# EasyEDA Pro project ProPrj_EIS-HW-V01_test_2026-05-23.epro, schematic Schematic1

## Sheets
1 P1: Create Date: 2025-07-22; Page Name: P1; Project Name: EIS-HW-V01; Schematic Name: Schematic1; Update Date: 2026-01-30
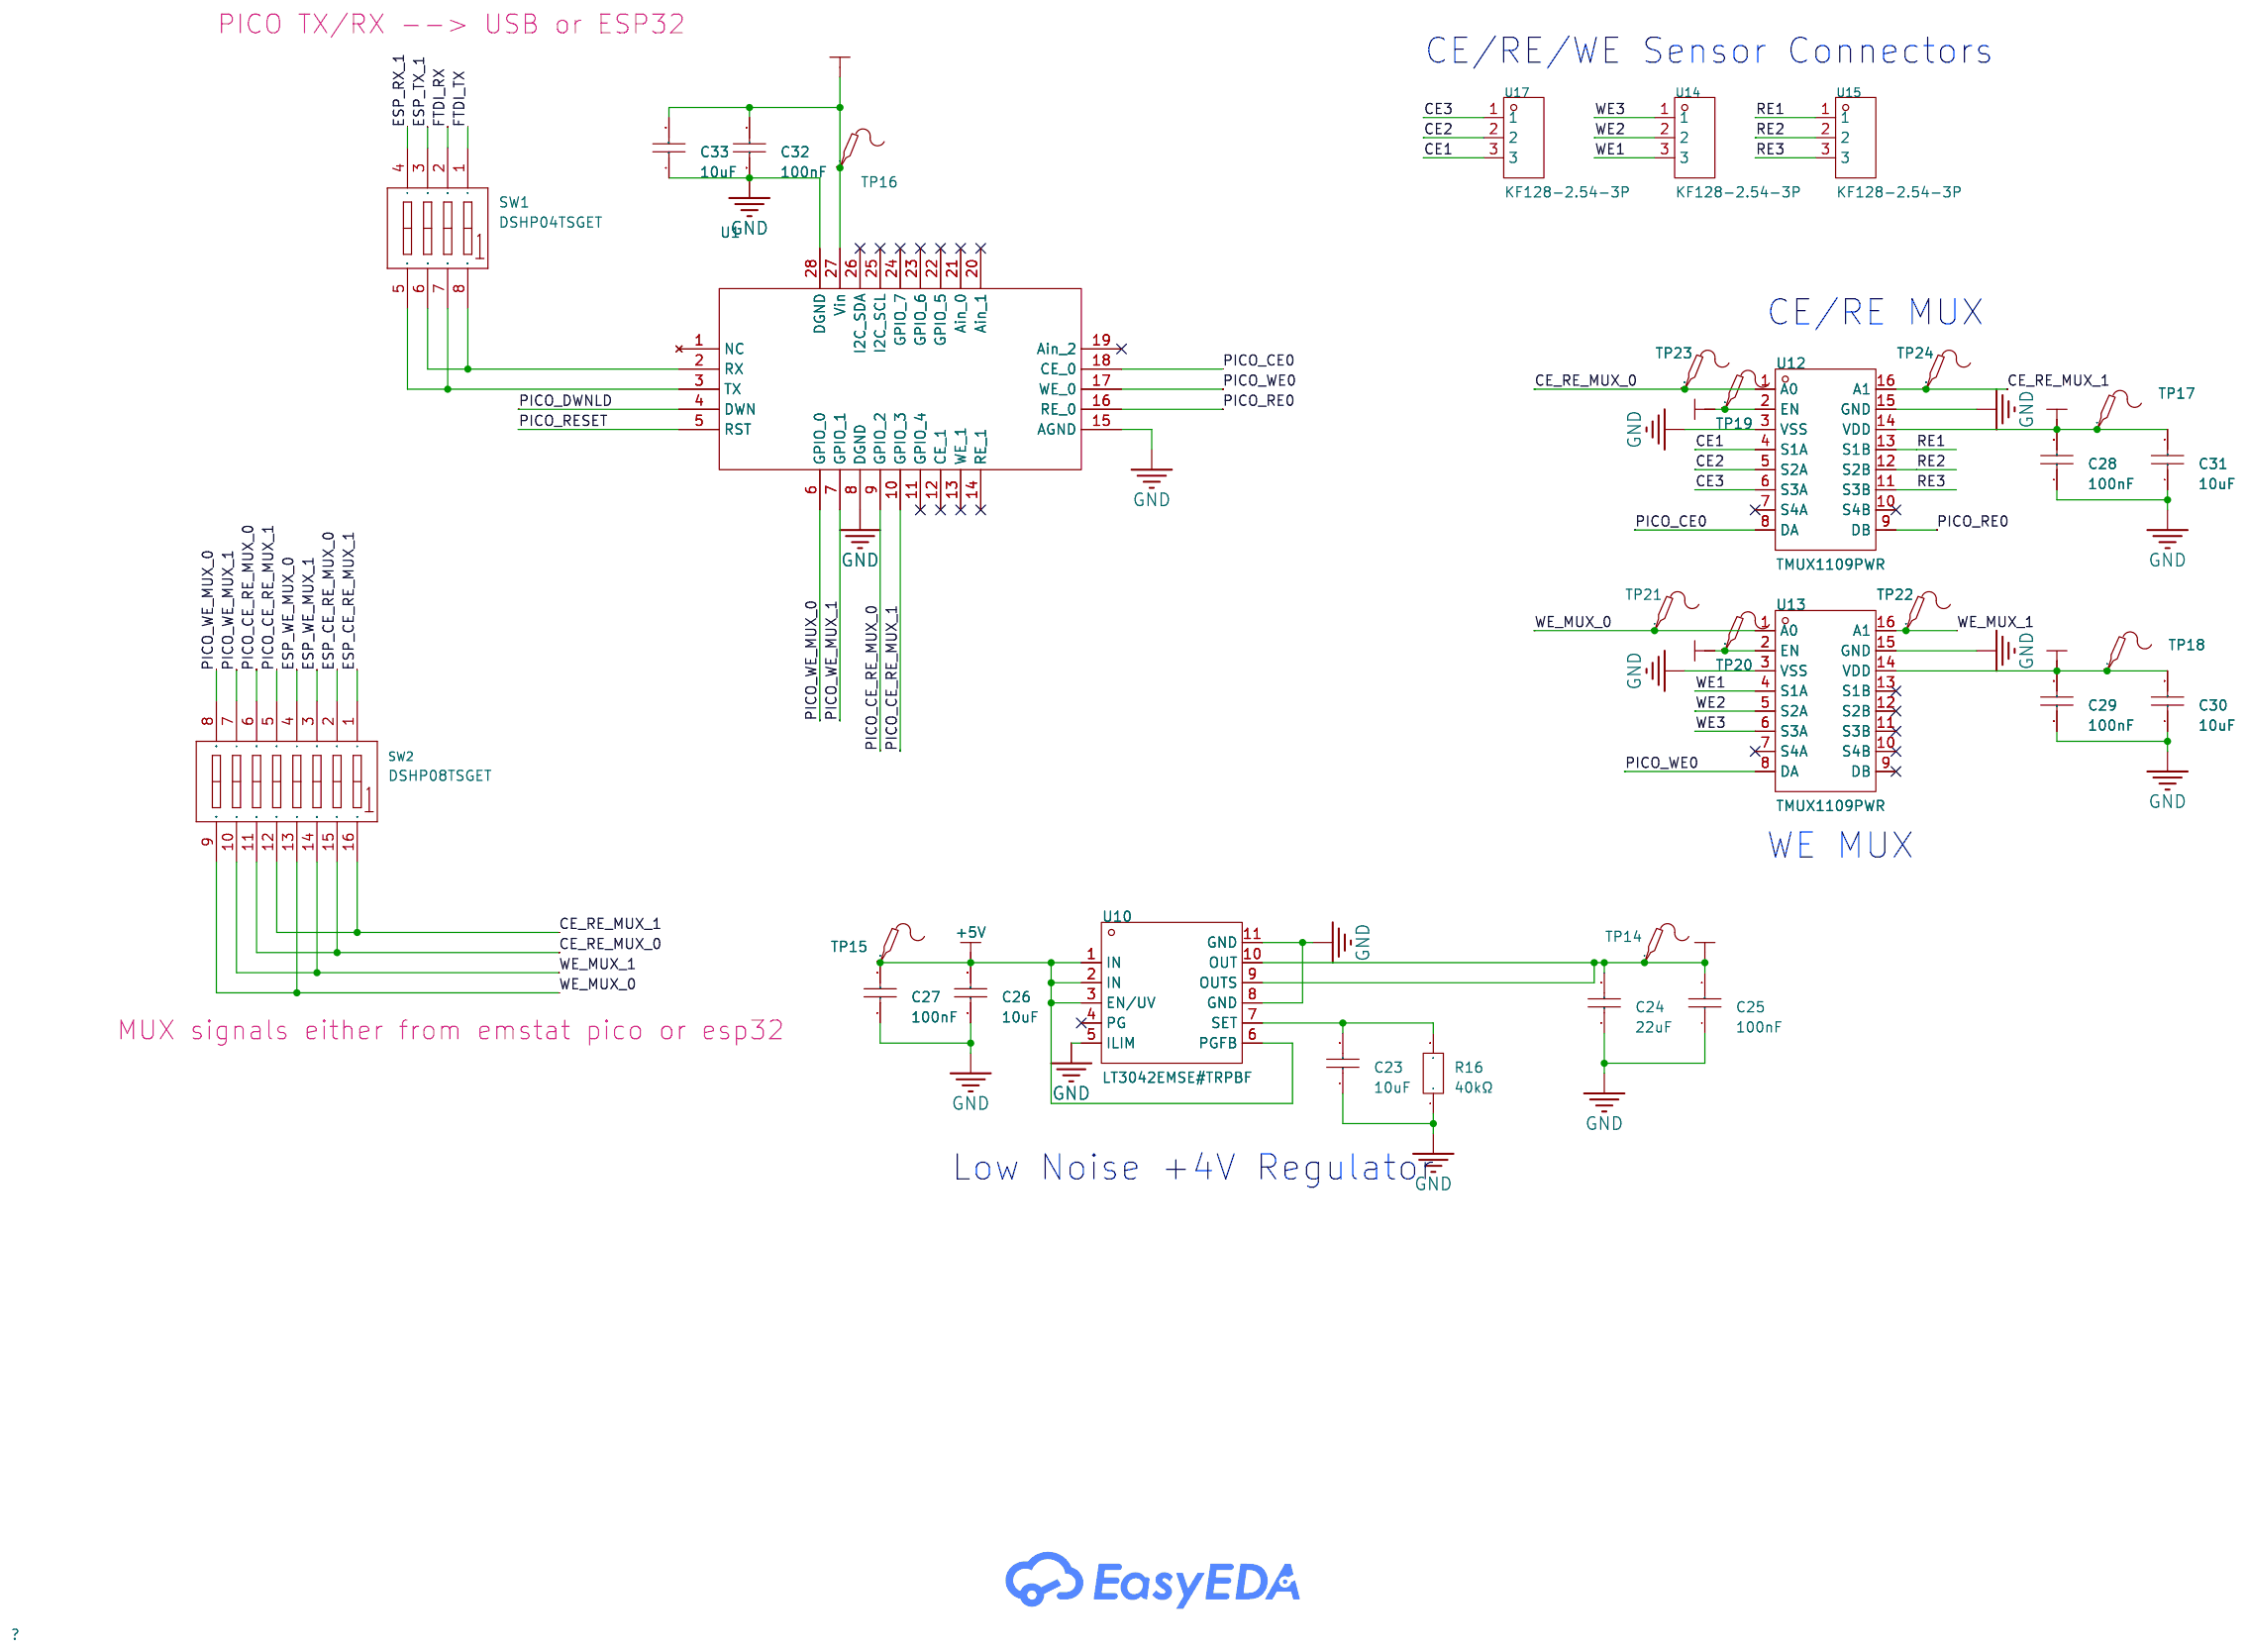
[diagram p0: P1]
2 P2: Create Date: 2025-07-30; Page Name: P2; Update Date: 2025-08-03
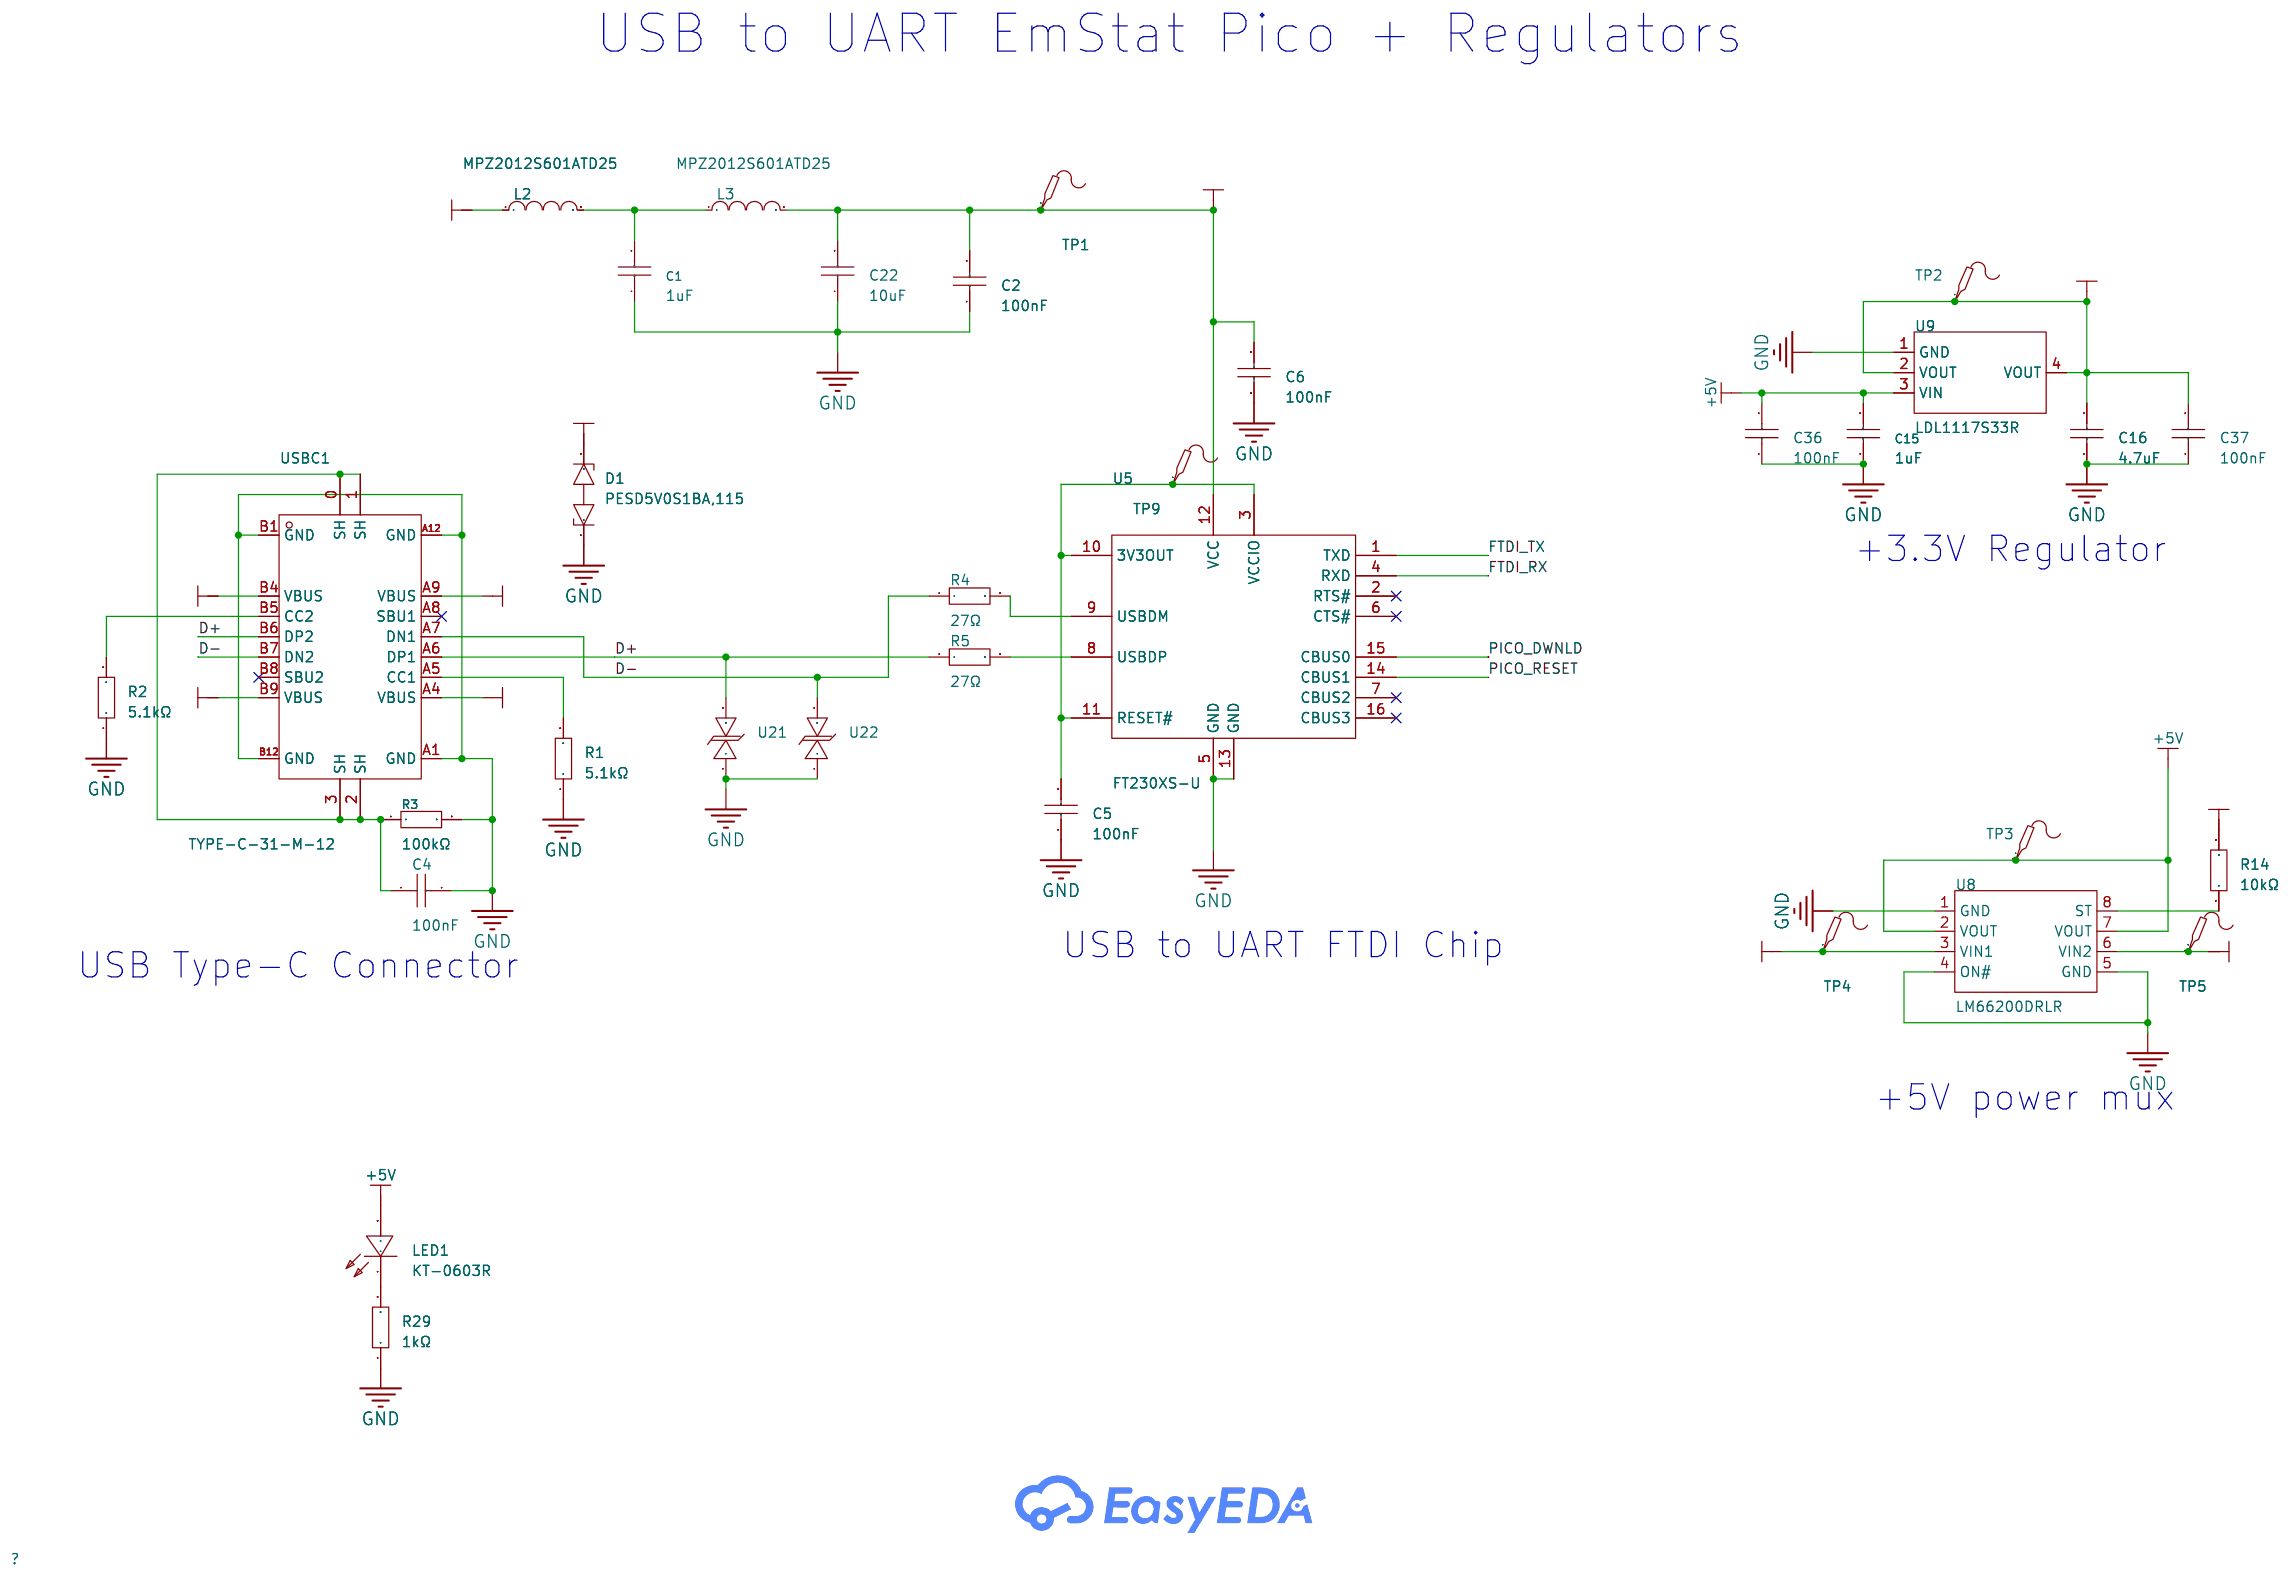
[diagram p1: P2]
3 P3: Create Date: 2025-07-30; Page Name: P3; Update Date: 2025-08-03
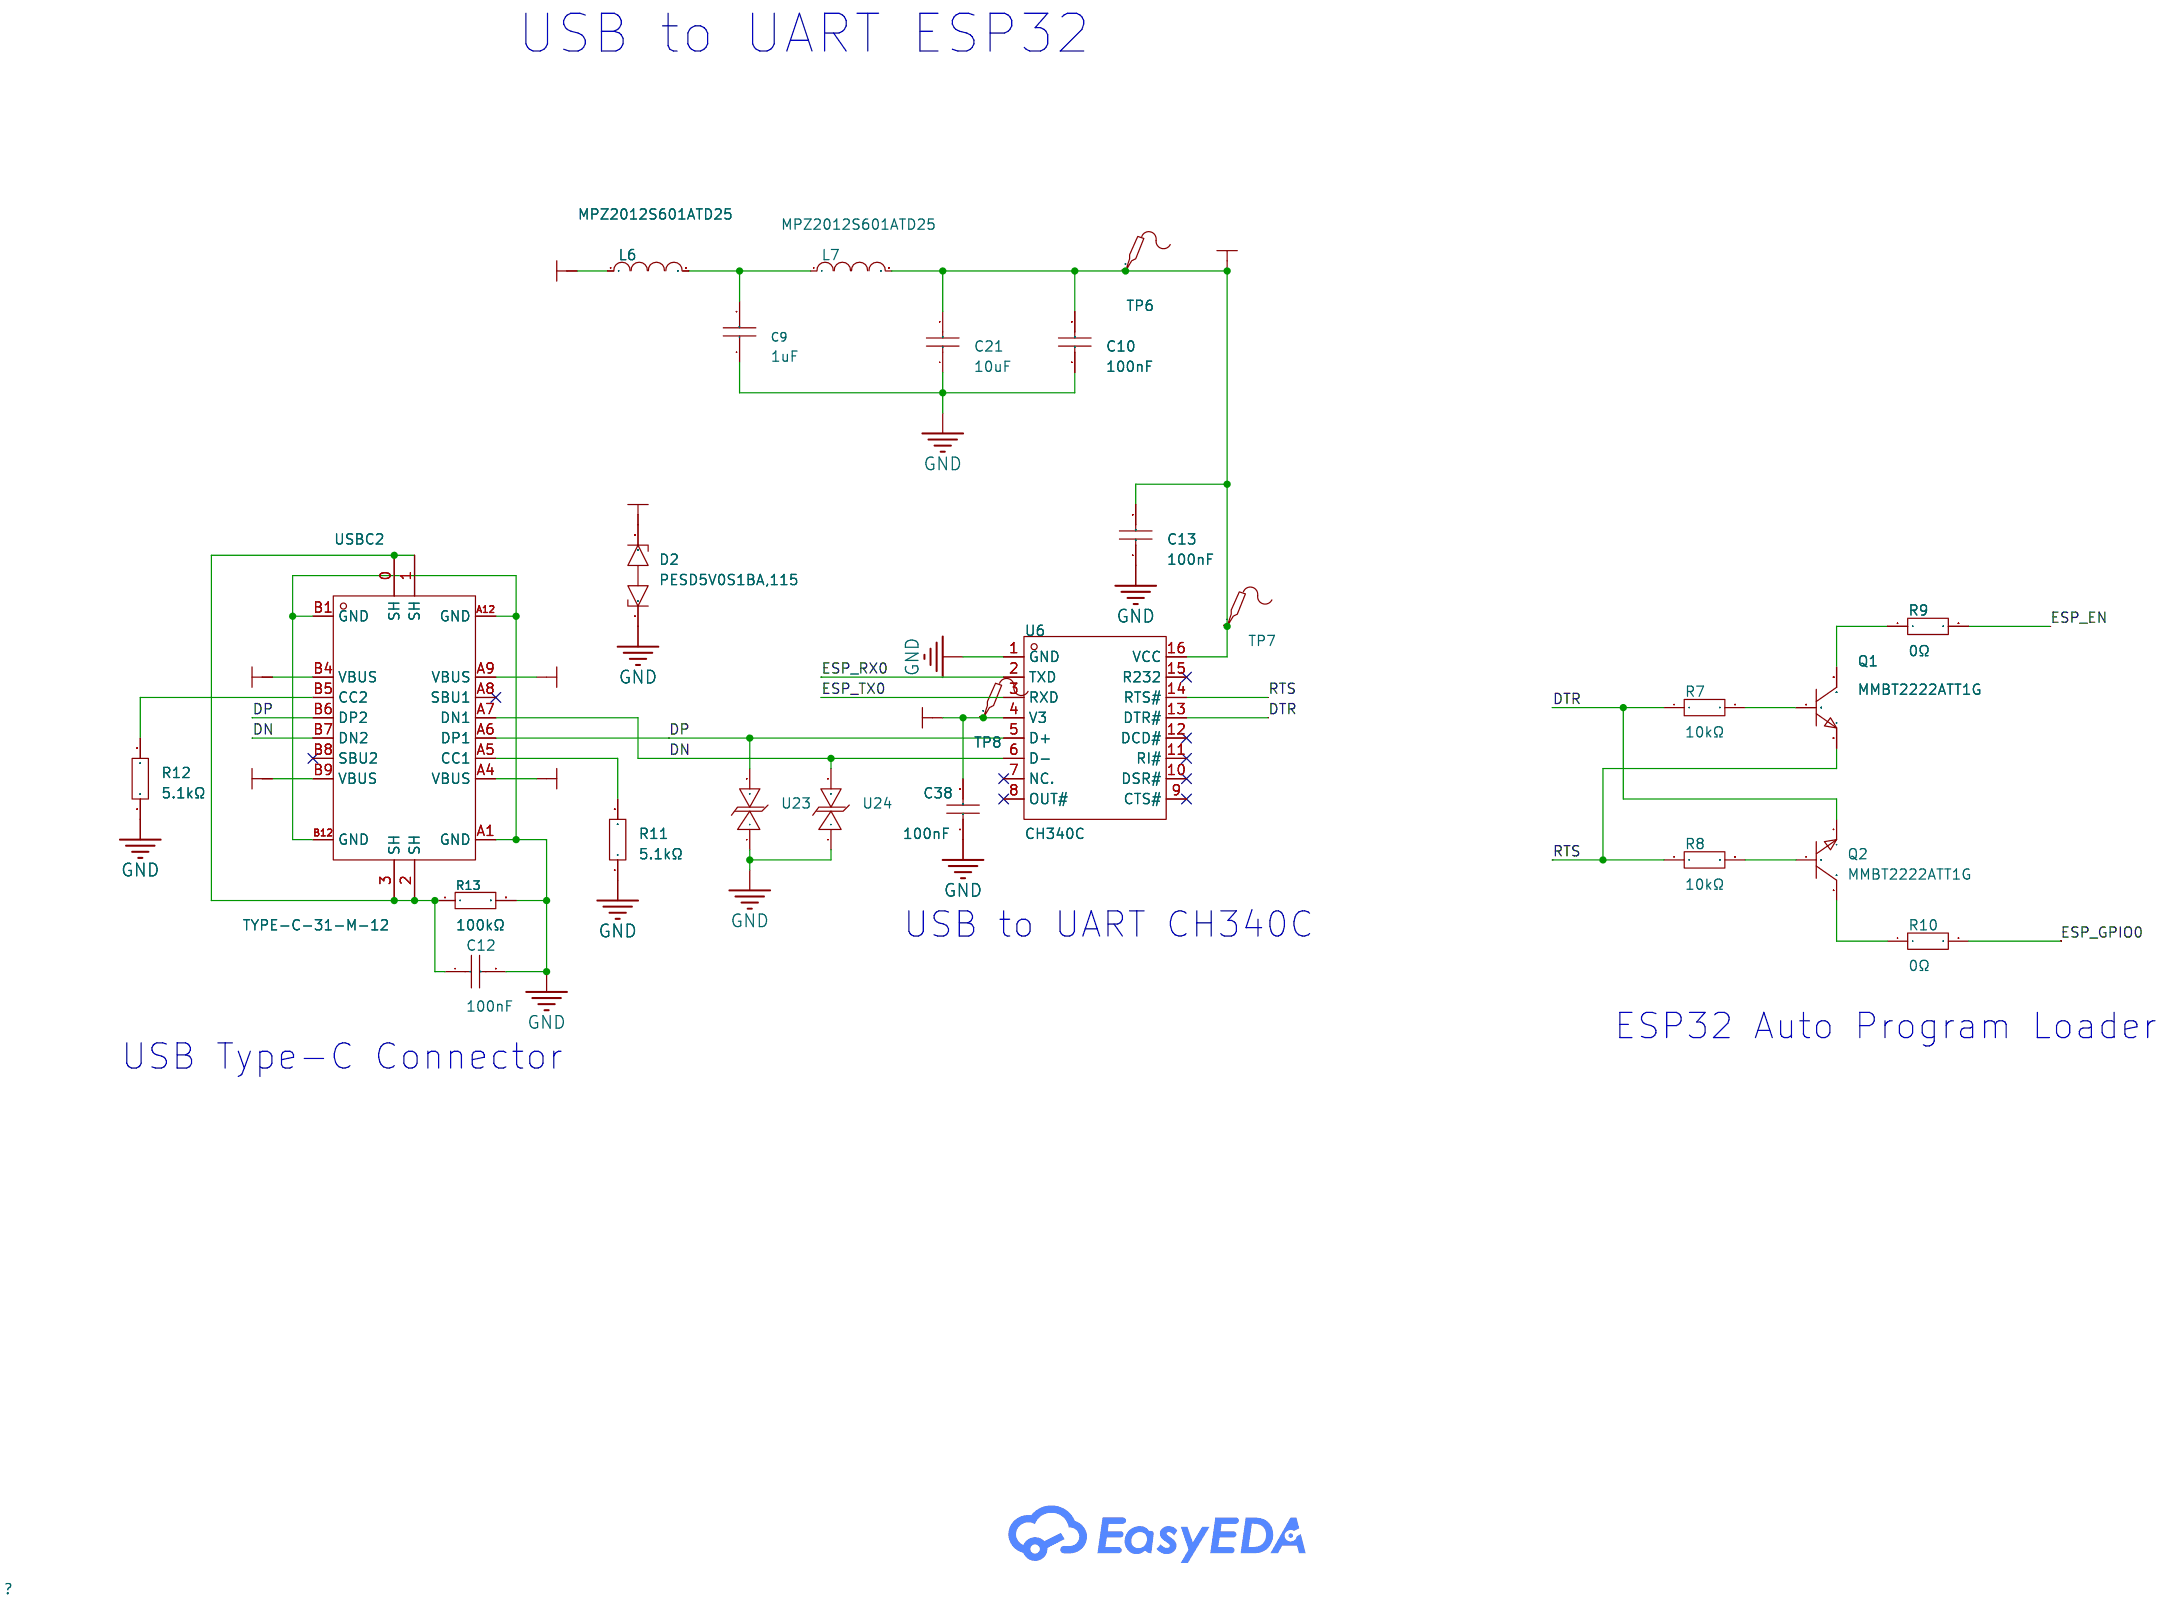
[diagram p2: P3]
4 P4: Create Date: 2025-07-30; Page Name: P4; Update Date: 2025-08-17
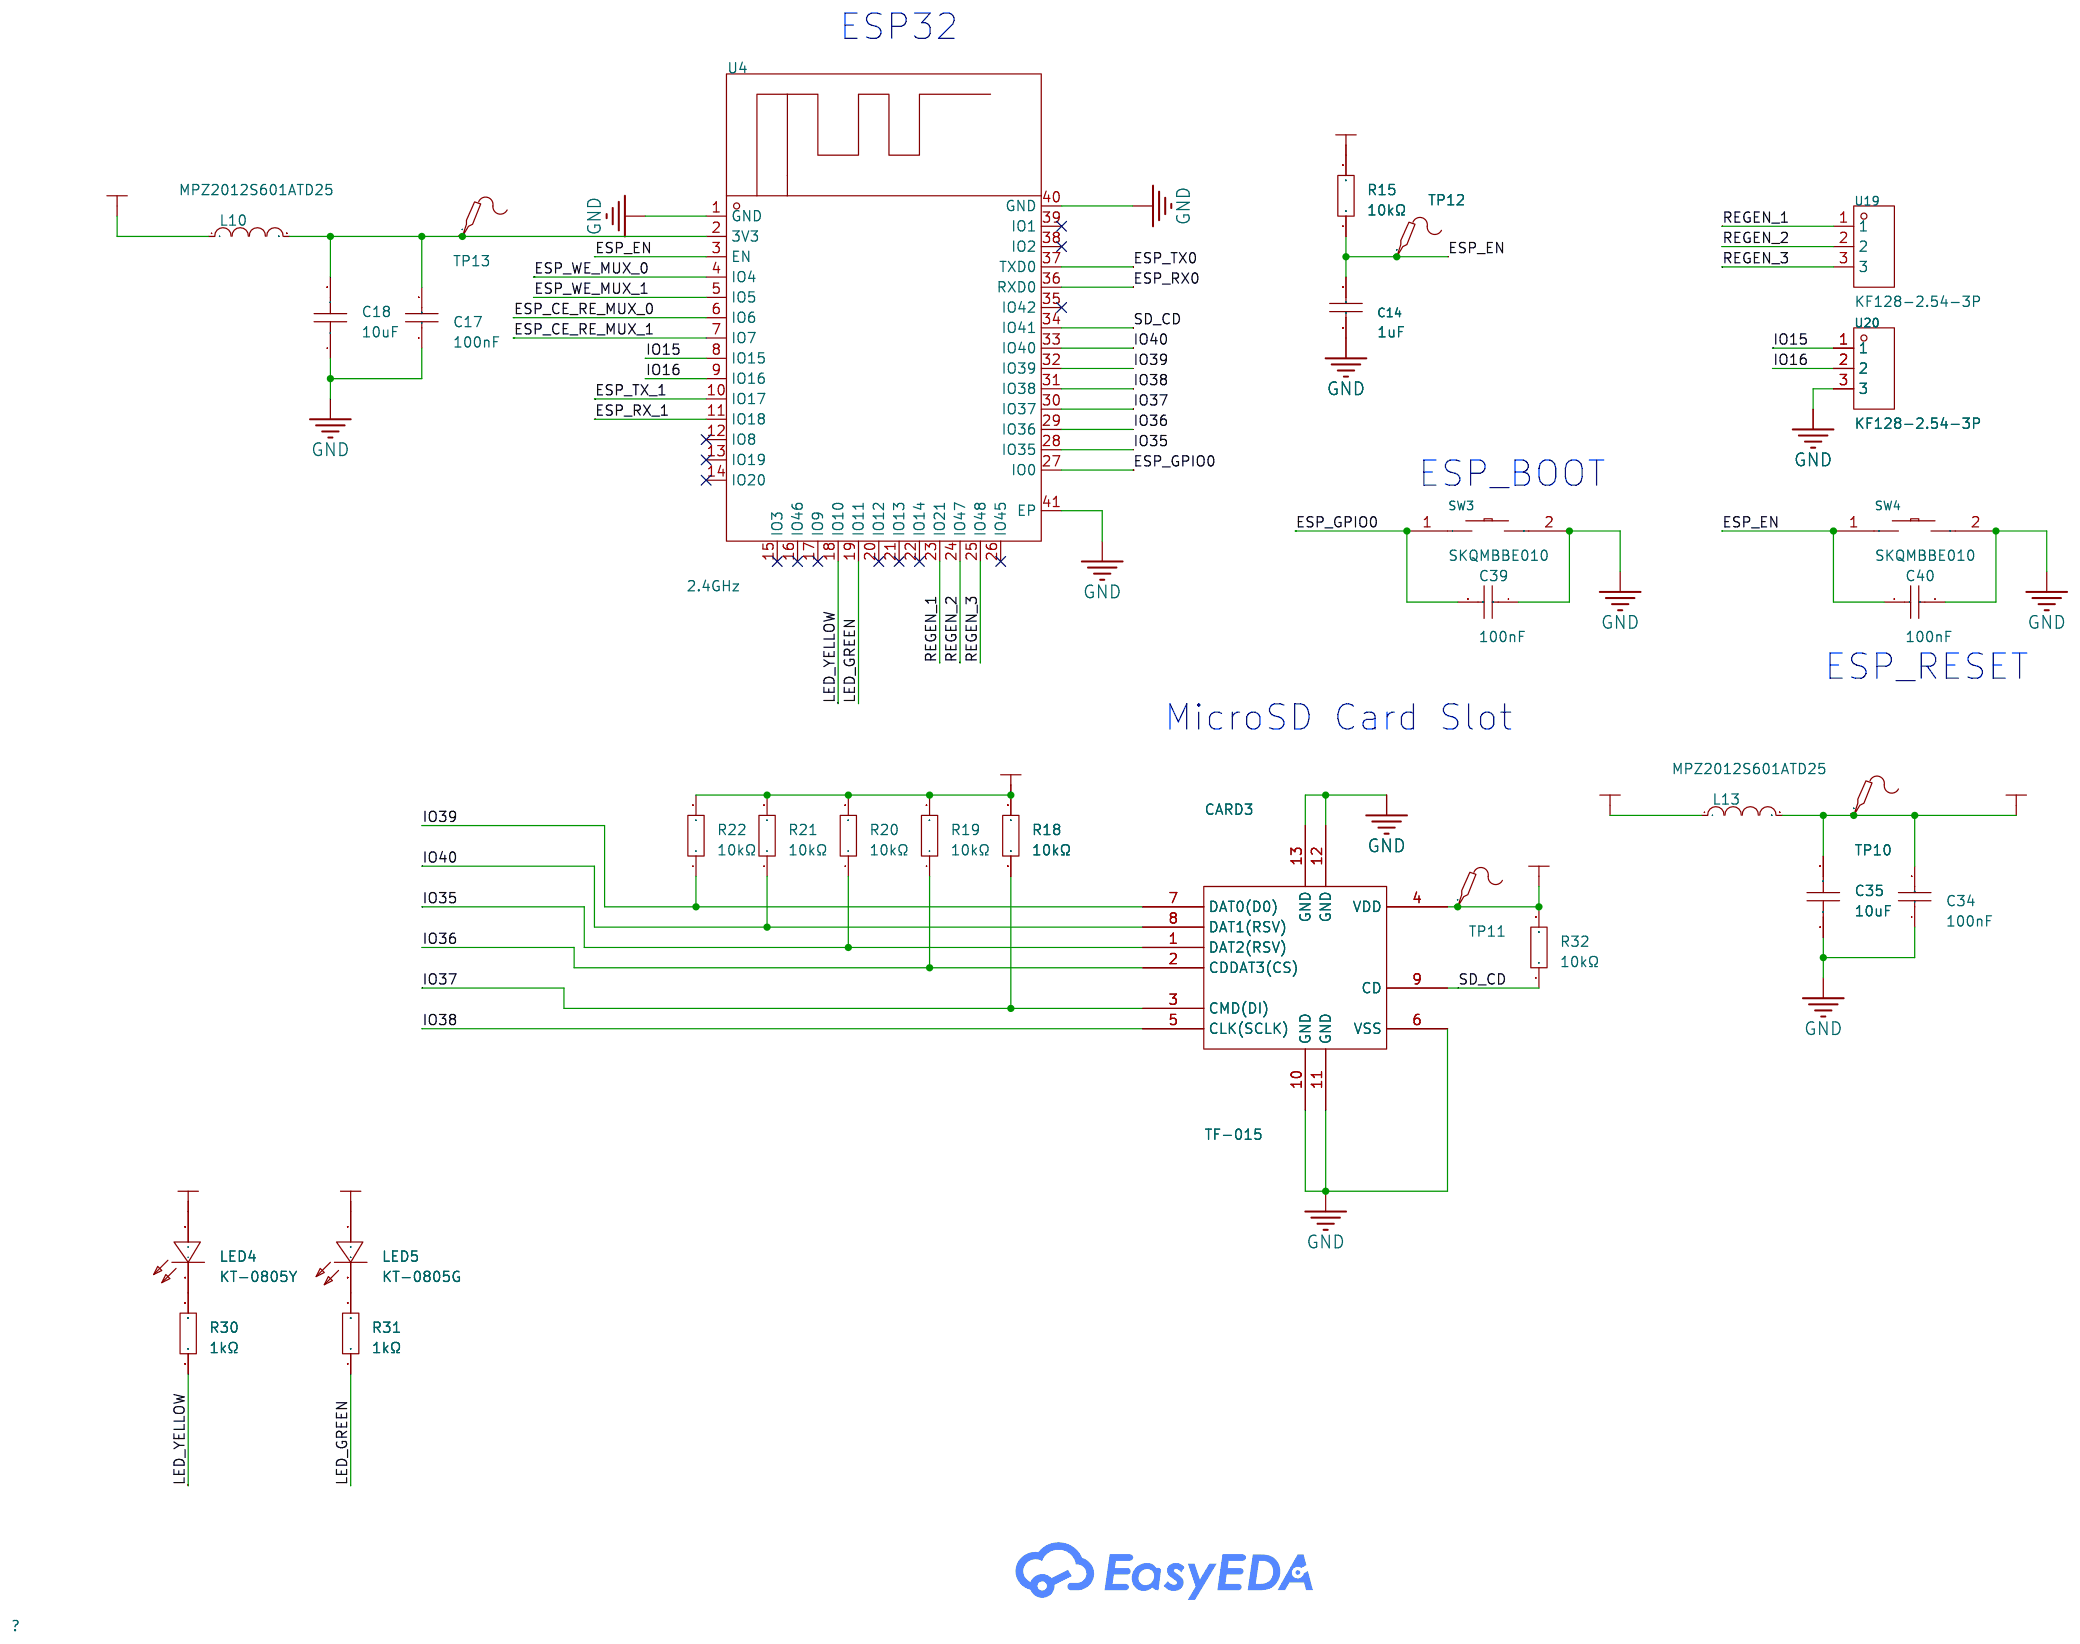
[diagram p3: P4]
5 P5: Create Date: 2025-08-01; Page Name: P5; Update Date: 2025-08-04
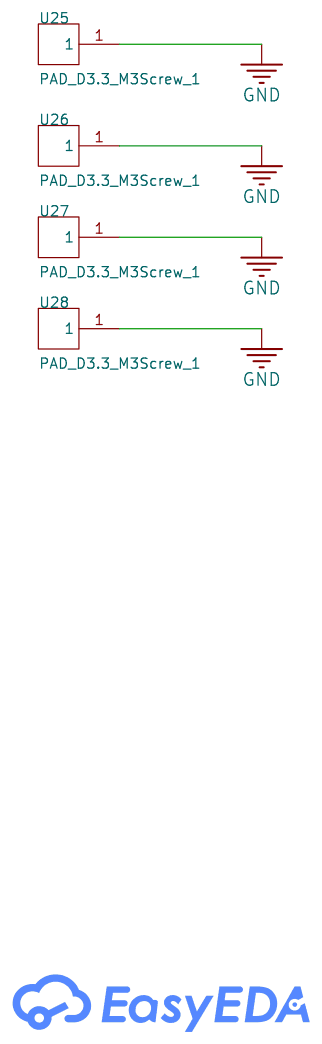
[diagram p4: P5]

## Parts
sheet P1
C23  10uF  [C1206]
C24  22uF  [C1206]
C25  100nF  [C0805]
C26  10uF  [C1206]
C27  100nF  [C0805]
C28  100nF  [C0805]
C29  100nF  [C0805]
C30  10uF  [C1206]
C31  10uF  [C1206]
C32  100nF  [C0805]
C33  10uF  [C1206]
R16  40kΩ  [R0603]
SW1  DSHP04TSGET  [SW-SMD_8P-L6.7-W5.4-P1.27-LS8.4]
SW2  DSHP08TSGET  [SW-SMD_DSHP08TSGET]
TP14  -  [Test-Point-0.5mm]
TP15  -  [Test-Point-0.5mm]
TP16  -  [Test-Point-0.5mm]
TP17  -  [Test-Point-0.5mm]
TP18  -  [Test-Point-0.5mm]
TP19  -  [Test-Point-0.5mm]
TP20  -  [Test-Point-0.5mm]
TP21  -  [Test-Point-0.5mm]
TP22  -  [Test-Point-0.5mm]
TP23  -  [Test-Point-0.5mm]
TP24  -  [Test-Point-0.5mm]
U1  EmStat Pico  [Emstat-Pico]
U10  LT3042EMSE#TRPBF  [MSOP-10_L3.0-W3.0-P0.50-LS5.0-BL-EP]
U12  TMUX1109PWR  [TSSOP-16_L5.0-W4.4-P0.64-LS6.4-BL]
U13  TMUX1109PWR  [TSSOP-16_L5.0-W4.4-P0.64-LS6.4-BL]
U14  KF128-2.54-3P  [CONN-TH_3P-P2.54_KF128-2.54-3P]
U15  KF128-2.54-3P  [CONN-TH_3P-P2.54_KF128-2.54-3P]
U17  KF128-2.54-3P  [CONN-TH_3P-P2.54_KF128-2.54-3P]
sheet P2
C1  1uF  [C0805]
C2  100nF  [C0805]
C4  100nF  [C0805]
C5  100nF  [C0805]
C6  100nF  [C0805]
C15  1uF  [C0805]
C16  4.7uF  [C0805]
C22  10uF  [C1206]
C36  100nF  [C0805]
C37  100nF  [C0805]
D1  PESD5V0S1BA,115  [SOD-323_L1.7-W1.3-LS2.5-BI]
L2  MPZ2012S601ATD25  [L0805]
L3  MPZ2012S601ATD25  [L0805]
LED1  KT-0603R  [LED0603-RD]
R1  5.1kΩ  [R0805]
R2  5.1kΩ  [R0805]
R3  100kΩ  [R0805]
R4  27Ω  [R0805]
R5  27Ω  [R0805]
R14  10kΩ  [R0805]
R29  1kΩ  [R0603]
TP1  -  [Test-Point-0.5mm]
TP2  -  [Test-Point-0.5mm]
TP3  -  [Test-Point-0.5mm]
TP4  -  [Test-Point-0.5mm]
TP5  -  [Test-Point-0.5mm]
TP9  -  [Test-Point-0.5mm]
U5  FT230XS-U  [SSOP-16_L5.0-W4.4-P0.65-LS6.4-BL]
U8  LM66200DRLR  [SOT-583-8_L2.1-W1.2-P0.50-LS1.6-BL]
U9  LDL1117S33R  [SOT-223-4_L6.5-W3.5-P2.30-LS7.0-BR]
U21  BNLESD5D5.0CT1G  [SOD-523_L1.2-W0.8-LS1.6-BI]
U22  BNLESD5D5.0CT1G  [SOD-523_L1.2-W0.8-LS1.6-BI]
USBC1  TYPE-C-31-M-12  [USB-C_SMD-TYPE-C-31-M-12]
sheet P3
C9  1uF  [C0805]
C10  100nF  [C0805]
C12  100nF  [C0805]
C13  100nF  [C0805]
C21  10uF  [C1206]
C38  100nF  [C0805]
D2  PESD5V0S1BA,115  [SOD-323_L1.7-W1.3-LS2.5-BI]
L6  MPZ2012S601ATD25  [L0805]
L7  MPZ2012S601ATD25  [L0805]
Q1  MMBT2222ATT1G  [SC-75-3_L1.6-W0.8-P1.00-LS1.6-BR]
Q2  MMBT2222ATT1G  [SC-75-3_L1.6-W0.8-P1.00-LS1.6-BR]
R7  10kΩ  [R0805]
R8  10kΩ  [R0805]
R9  0Ω  [R0805]
R10  0Ω  [R0805]
R11  5.1kΩ  [R0805]
R12  5.1kΩ  [R0805]
R13  100kΩ  [R0805]
TP6  -  [Test-Point-0.5mm]
TP7  -  [Test-Point-0.5mm]
TP8  -  [Test-Point-0.5mm]
U6  CH340C  [SOP-16_L10.0-W3.9-P1.27-LS6.0-BL]
U23  BNLESD5D5.0CT1G  [SOD-523_L1.2-W0.8-LS1.6-BI]
U24  BNLESD5D5.0CT1G  [SOD-523_L1.2-W0.8-LS1.6-BI]
USBC2  TYPE-C-31-M-12  [USB-C_SMD-TYPE-C-31-M-12]
sheet P4
C14  1uF  [C0805]
C17  100nF  [C0805]
C18  10uF  [C0805]
C34  100nF  [C0805]
C35  10uF  [C0805]
C39  100nF  [C0805]
C40  100nF  [C0805]
CARD3  TF-015  [TF-SMD_TF-015]
L10  MPZ2012S601ATD25  [L0805]
L13  MPZ2012S601ATD25  [L0805]
LED4  KT-0805Y  [LED0805-R-RD]
LED5  KT-0805G  [LED0805-R-RD]
R15  10kΩ  [R0805]
R18  10kΩ  [R0805]
R19  10kΩ  [R0805]
R20  10kΩ  [R0805]
R21  10kΩ  [R0805]
R22  10kΩ  [R0805]
R30  1kΩ  [R0603]
R31  1kΩ  [R0603]
R32  10kΩ  [R0805]
SW3  SKQMBBE010  [KEY-SMD_L6.0-W3.5-LS6.2]
SW4  SKQMBBE010  [KEY-SMD_L6.0-W3.5-LS6.2]
TP10  -  [Test-Point-0.5mm]
TP11  -  [Test-Point-0.5mm]
TP12  -  [Test-Point-0.5mm]
TP13  -  [Test-Point-0.5mm]
U4  2.4GHz  [WIFIM-SMD_ESP32-S3-WROOM-1-N8]
U19  KF128-2.54-3P  [CONN-TH_3P-P2.54_KF128-2.54-3P]
U20  KF128-2.54-3P  [CONN-TH_3P-P2.54_KF128-2.54-3P]
sheet P5
U25  PAD_D3.3_M3Screw_1  [SMD_BD5.5-D3.9]
U26  PAD_D3.3_M3Screw_1  [SMD_BD5.5-D3.9]
U27  PAD_D3.3_M3Screw_1  [SMD_BD5.5-D3.9]
U28  PAD_D3.3_M3Screw_1  [SMD_BD5.5-D3.9]

## Library data of the parts
C21-C23 C26 C30 C31 C33 = CL31A106KBHNNNE: Capacitance: Tolerance:±10% Tolerance:±10% Voltage Rated: Temperature Coefficient:; LCSC Part Name: 10uF ±10% 50V; Supplier Part: C13585; Manufacturer: SAMSUNG(三星); Supplier Footprint: 1206; JLCPCB Part Class: Basic Part; Datasheet: https://atta.szlcsc.com/upload/public/pdf/source/20160218/1457707763339.pdf; Supplier: LCSC; Tolerance: ±10%
C24 = CL31A226KAHNNNE: Capacitance: Tolerance:±10% Tolerance:±10% Voltage Rated: Temperature Coefficient:; LCSC Part Name: 22uF ±10% 25V; Supplier Part: C12891; Manufacturer: SAMSUNG(三星); Supplier Footprint: 1206; Datasheet: https://atta.szlcsc.com/upload/public/pdf/source/20160218/1457707763339.pdf; Supplier: LCSC; Tolerance: ±10%
C2 C4-C6 C10 C12 C13 C17 C25 C27-C29 C32 C34 C36-C40 = CL21B104KCFNNNE: Capacitance: Tolerance:±10% Tolerance:±10% Voltage Rated: Temperature Coefficient:; LCSC Part Name: 100nF ±10% 100V; Supplier Part: C28233; Manufacturer: SAMSUNG(三星); Supplier Footprint: 0805; Datasheet: https://atta.szlcsc.com/upload/public/pdf/source/20160218/1457707763339.pdf; Supplier: LCSC; Tolerance: ±10%
R16 = RT0603BRD0740KL: Type:Thin Film Resistor Resistance: Tolerance:±0.1% Tolerance:±0.1% Power(Watts): Temperature Coefficient:±25ppm/℃ Temperature Coefficient:±25ppm/℃ Operating Temperature Range:-55℃~+155℃ Operating Temperature Range:-55℃~+155℃; LCSC Part Name: 薄膜电阻 40kΩ ±0.1% 100mW; Supplier Part: C861392; Manufacturer: YAGEO(国巨); Supplier Footprint: 0603; JLCPCB Part Class: Extended Part; Datasheet: https://atta.szlcsc.com/upload/public/pdf/source/20200610/C326738_5639A9F1B6EB6E4AE2197577D3456E7F.pdf; Supplier: LCSC; Type: Thin Film Resistor; Tolerance: ±0.1%; Temperature Coefficient: ±25ppm/℃; Operating Temperature Range: -55℃~+155℃
SW1 = DSHP04TSGET: Type:平拨,凹槽式 Circuit:SPST Number of Positions:4Bit Lead Pitch:1.27mm Operating Life:- Color:Black; LCSC Part Name: 4位 1.27间距 拨码开关; Supplier Part: C40736; Manufacturer: YE; Supplier Footprint: SMD-8P,5.4x6.6mm; JLCPCB Part Class: Extended Part; Datasheet: https://atta.szlcsc.com/upload/public/pdf/source/20150928/1457707425288.pdf; Supplier: LCSC; Type: 平拨,凹槽式; Circuit: SPST; Number of Positions: 4Bit; Lead Pitch: 1.27mm; Color: Black
SW2 = DSHP08TSGET: Type:平拨,凹槽式 Circuit:SPST Number of Positions:8Bit Lead Pitch:1.27mm Operating Life:- Color:Black; LCSC Part Name: 8位 1.27间距; Supplier Part: C40738; Manufacturer: YE; Supplier Footprint: SMD-16P,5.4x11.7mm; JLCPCB Part Class: Extended Part; Datasheet: https://atta.szlcsc.com/upload/public/pdf/source/20150928/1457707425342.pdf; Supplier: LCSC; Type: 平拨,凹槽式; Circuit: SPST; Number of Positions: 8Bit; Lead Pitch: 1.27mm; Color: Black
TP1-TP24 = Test-Point: Test Point 测试点
U1 = emstat-pico: EmStat Pico module
U10 = LT3042EMSE#TRPBF: Output Type:Adjustable Maximum Input Voltage:20V Output Voltage:0V~15V Output Voltage:0V~15V Output Current:200mA Power Supply Rejection Ratio (PSRR):117dB@(120Hz)；56dB@(10MHz) Dropout Voltage:350mV@(200mA) standby current:- Noise:- Feature:Low ESR；ESD Pr; LCSC Part Name: 20V，200mA，超低噪声，超高PSRR射频线性稳压器; Supplier Part: C461518; Manufacturer: ADI(亚德诺); Supplier Footprint: MSOP-10-EP; JLCPCB Part Class: Extended Part; Datasheet: https://atta.szlcsc.com/upload/public/pdf/source/20191125/C461518_D70E324BD4D3ECAF70A76CB5055CFBFB.pdf; Supplier: LCSC; Output Type: Adjustable; Maximum Input Voltage: 20V; Output Voltage: 0V~15V; Output Current: 200mA; Power Supply Rejection Ratio (PSRR): 117dB@(120Hz)；56dB@(10MHz); Dropout Voltage: 350mV@(200mA); Feature: Low ESR；ESD Protection；Surge Protection；Open Drain Power Good (PG) Output；Short-Circuit  Protection；Thermal Protection(TSD)；Under-voltage Lockout；Overcurrent Protection(OCP)；With ability；Anti-Siphon; Operating Temperature: -40℃~+125℃; Output Polarity: Positive electrode; Number of Outputs: 1
U12 U13 = TMUX1109PWR: Switch Circuit:Double Pole Four Throw (DP4T) Number of Channels:4 Supply Voltage:1.08V~5.5V Supply Voltage:1.08V~5.5V Turn-on time:20ns On-State Resistance (Max):4.9Ω Turn-off time:20ns Operating Temperature:-40℃~+125℃ Operating Temperature:-40℃~+125℃; LCSC Part Name: TMUX1109 5V、±2.5V、低泄漏电流、4:1、2通道精密多路复用器; Supplier Part: C2673338; Manufacturer: TI(德州仪器); Supplier Footprint: TSSOP-16-175mil; Datasheet: https://www.ti.com/cn/lit/gpn/tmux1109; Supplier: LCSC; Switch Circuit: Double Pole Four Throw (DP4T); Number of Channels: 4; Supply Voltage: 1.08V~5.5V; Turn-on time: 20ns; On-State Resistance (Max): 4.9Ω; Turn-off time: 20ns; Operating Temperature: -40℃~+125℃
U14 U15 U17 U19 U20 = KF128-2.54-3P: Structure:1x3P Pitch:2.54mm Color:Green Mounting Style:Straight Current Rating (Max):8A Voltage Rating (Max):130V Number of Pins:3P Number of Rows:1 Wire Gauge - AWG:18~26 Wire Gauge - AWG:18~26 Wire Gauge - mm2:1 Wire Gauge - mm2:1 Number of PINs Per Row; LCSC Part Name: 2.54mm 1x3P 排数:1 每排P数:3 直插; Supplier Part: C474921; Manufacturer: KEFA(科发); Supplier Footprint: 插件,P=2.54mm; Datasheet: https://atta.szlcsc.com/upload/public/pdf/source/20230317/0E5ECA9DB49110BC3219D12632CEA6EE.pdf; Supplier: LCSC; Structure: 1x3P; Pitch: 2.54mm; Color: Green; Mounting Style: Straight; Current Rating (Max): 8A; Voltage Rating (Max): 130V; Number of Pins: 3P; Number of Rows: 1; Wire Gauge - AWG: 18~26; Wire Gauge - mm2: 1; Number of PINs Per Row: 3; Operating Temperature Range: -40℃~+105℃
C1 C9 C14 C15 = CL21B105KBFNNNE: Capacitance: Tolerance:±10% Tolerance:±10% Voltage Rated: Temperature Coefficient:; LCSC Part Name: 1uF ±10% 50V; Supplier Part: C28323; Manufacturer: SAMSUNG(三星); Supplier Footprint: 0805; JLCPCB Part Class: Basic Part; Datasheet: https://atta.szlcsc.com/upload/public/pdf/source/20160218/1457707763339.pdf; Supplier: LCSC; Tolerance: ±10%
C16 = CL21A475KAQNNNE: Capacitance: Tolerance:±10% Tolerance:±10% Voltage Rated: Temperature Coefficient:; LCSC Part Name: 4.7uF ±10% 25V; Supplier Part: C1779; Manufacturer: SAMSUNG(三星); Supplier Footprint: 0805; JLCPCB Part Class: Basic Part; Datasheet: https://atta.szlcsc.com/upload/public/pdf/source/20160218/1457707763339.pdf; Supplier: LCSC; Tolerance: ±10%
D1 D2 = PESD5V0S1BA,115: polarity:Bidirectional Reverse Stand-Off Voltage (Vrwm):5V Maximum Clamping Voltage:14V Peak Pulse Current (Ipp):12A Peak Pulse Power Dissipation (Ppp):130W Breakdown Voltage:5.5V Type:TVS; Supplier Part: C19224; Manufacturer: Nexperia(安世); Supplier Footprint: SOD-323; JLCPCB Part Class: Extended Part; Datasheet: https://atta.szlcsc.com/upload/public/pdf/source/20240724/05BBDE0A485669700F5B6068885A688C.pdf; Supplier: LCSC; polarity: Bidirectional; Reverse Stand-Off Voltage (Vrwm): 5V; Maximum Clamping Voltage: 14V; Peak Pulse Current (Ipp): 12A; Peak Pulse Power Dissipation (Ppp): 130W; Breakdown Voltage: 5.5V; Type: TVS
L2 L3 L6 L7 L10 L13 = MPZ2012S601ATD25: Impedance @ Frequency:600Ω@100MHz Tolerance:±25% Tolerance:±25% DC Resistance:100mΩ Current Rating:2A Circuits:1; LCSC Part Name: 单路 0805磁珠 阻抗600Ω@100MHz; Supplier Part: C81034; Manufacturer: TDK; Supplier Footprint: 0805; Datasheet: https://atta.szlcsc.com/upload/public/pdf/source/20180613/C81034_2FD391D3901DD38A3F2C22B18566951A.pdf; Supplier: LCSC; Impedance @ Frequency: 600Ω@100MHz; Tolerance: ±25%; DC Resistance: 100mΩ; Current Rating: 2A; Circuits: 1
LED1 = KT-0603R: Emitted Color:Red Power Dissipation:- Forward Current:- Dominant Wavelength:- Dominant Wavelength:- Peak Wavelength:- Diode Configuration:- Lens Color:- Color Temperature:- Color Temperature:- Viewing Angle:- Mounting Sytle:- Operating Temperature:-40℃~+8; LCSC Part Name: 0603 红灯 高亮; Supplier Part: C2286; Manufacturer: KENTO; Supplier Footprint: 0603; JLCPCB Part Class: Basic Part; Datasheet: https://atta.szlcsc.com/upload/public/pdf/source/20160616/1466072038404.pdf; Supplier: LCSC; Emitted Color: Red; Operating Temperature: -40℃~+85℃
R1 R2 R11 R12 = 0805W8F5101T5E: Type:Thick Film Resistors Resistance:5.1kΩ Tolerance:±1% Tolerance:±1% Power(Watts): Overload Voltage (Max): Temperature Coefficient:±100ppm/℃ Temperature Coefficient:±100ppm/℃ Operating Temperature Range:-55℃~+155℃ Operating Temperature Range:-55℃~+155℃; LCSC Part Name: 5.1kΩ ±1% 125mW 厚膜电阻; Supplier Part: C27834; Manufacturer: UNI-ROYAL(厚声); Supplier Footprint: 0805; Datasheet: https://atta.szlcsc.com/upload/public/pdf/source/20200306/C422600_1E6D84923E4A46A82E41ADD87F860B5C.pdf; Supplier: LCSC; Type: Thick Film Resistors; Tolerance: ±1%; Temperature Coefficient: ±100ppm/℃; Operating Temperature Range: -55℃~+155℃
R3 R13 = 0805W8F1003T5E: Type:Thick Film Resistor Resistance:100kΩ Tolerance:±1% Tolerance:±1% Power(Watts):125mW Voltage-Supply(Max):150V Temperature Coefficient:±100ppm/℃ Temperature Coefficient:±100ppm/℃ Operating Temperature:-55℃~+155℃ Operating Temperature:-55℃~+155℃; LCSC Part Name: 100kΩ ±1% 125mW 厚膜电阻; Supplier Part: C149504; Manufacturer: UNI-ROYAL(厚声); Supplier Footprint: 0805; JLCPCB Part Class: Basic Part; Datasheet: https://atta.szlcsc.com/upload/public/pdf/source/20200306/C422600_1E6D84923E4A46A82E41ADD87F860B5C.pdf; Supplier: LCSC; Type: Thick Film Resistor; Tolerance: ±1%; Power(Watts): 125mW; Voltage-Supply(Max): 150V; Temperature Coefficient: ±100ppm/℃; Operating Temperature: -55℃~+155℃
R4 R5 = 0805W8F270JT5E: Type:Thick Film Resistors Resistance:27Ω Tolerance:±1% Tolerance:±1% Power(Watts): Overload Voltage (Max): Temperature Coefficient:±100ppm/℃ Temperature Coefficient:±100ppm/℃ Operating Temperature Range:-55℃~+155℃ Operating Temperature Range:-55℃~+155℃; LCSC Part Name: 27Ω ±1% 125mW 厚膜电阻; Supplier Part: C17594; Manufacturer: UNI-ROYAL(厚声); Supplier Footprint: 0805; JLCPCB Part Class: Extended Part; Datasheet: https://atta.szlcsc.com/upload/public/pdf/source/20200306/C422600_1E6D84923E4A46A82E41ADD87F860B5C.pdf; Supplier: LCSC; Type: Thick Film Resistors; Tolerance: ±1%; Temperature Coefficient: ±100ppm/℃; Operating Temperature Range: -55℃~+155℃
R7 R8 R14 R15 R18-R22 R32 = 0805W8F1002T5E: Type:Thick Film Resistor Resistance:10kΩ Tolerance:±1% Tolerance:±1% Power(Watts):125mW Voltage-Supply(Max):150V Temperature Coefficient:±100ppm/℃ Temperature Coefficient:±100ppm/℃ Operating Temperature:-55℃~+155℃ Operating Temperature:-55℃~+155℃; LCSC Part Name: 10kΩ ±1% 125mW 厚膜电阻; Supplier Part: C17414; Manufacturer: UNI-ROYAL(厚声); Supplier Footprint: 0805; JLCPCB Part Class: Basic Part; Datasheet: https://atta.szlcsc.com/upload/public/pdf/source/20200306/C422600_1E6D84923E4A46A82E41ADD87F860B5C.pdf; Supplier: LCSC; Type: Thick Film Resistor; Tolerance: ±1%; Power(Watts): 125mW; Voltage-Supply(Max): 150V; Temperature Coefficient: ±100ppm/℃; Operating Temperature: -55℃~+155℃
R29-R31 = 0603WAF1001T5E: Type:Thick Film Resistors Resistance:1kΩ Tolerance:±1% Tolerance:±1% Power(Watts): Overload Voltage (Max): Temperature Coefficient:±100ppm/℃ Temperature Coefficient:±100ppm/℃ Operating Temperature Range:-55℃~+155℃ Operating Temperature Range:-55℃~+155℃; LCSC Part Name: 1kΩ ±1% 100mW 厚膜电阻; Supplier Part: C21190; Manufacturer: UNI-ROYAL(厚声); Supplier Footprint: 0603; JLCPCB Part Class: Basic Part; Datasheet: https://atta.szlcsc.com/upload/public/pdf/source/20200306/C422600_1E6D84923E4A46A82E41ADD87F860B5C.pdf; Supplier: LCSC; Type: Thick Film Resistors; Tolerance: ±1%; Temperature Coefficient: ±100ppm/℃; Operating Temperature Range: -55℃~+155℃
U5 = FT230XS-U: Applications Function:USB to UART Protocol:- Voltage - Supply:3.3V~5V Voltage - Supply:3.3V~5V Operating Temperature:-40℃~+85℃ Operating Temperature:-40℃~+85℃; LCSC Part Name: FT230X USB至基本UART IC; Supplier Part: C132162; Manufacturer: FTDI(飞特帝亚); Supplier Footprint: SSOP-16-150mil; Datasheet: https://atta.szlcsc.com/upload/public/pdf/source/20241220/CE217FBE63377D64E219ED87BA0130F6.pdf; Supplier: LCSC; Applications Function: USB to UART; Voltage - Supply: 3.3V~5V; Operating Temperature: -40℃~+85℃
U8 = LM66200DRLR: Supplier Part: C3235556; Manufacturer: TI(德州仪器); Supplier Footprint: SOT-583; JLCPCB Part Class: Extended Part; Datasheet: https://www.ti.com/cn/lit/gpn/lm66200; Supplier: LCSC
U9 = LDL1117S33R: Output Type:Fixed Voltage - Supply:18V Output Voltage:3.3V Output Voltage:3.3V Output Current:1.2A Power Supply Rejection Ratio (PSRR):87dB@(120Hz) Voltage Dropout:600mV@(1.2A) standby current:500uA Noise:60uVrms Features:Over Temperature Protection；Over; LCSC Part Name: 输入18V 输出3.3V 1.2A; Supplier Part: C435835; Manufacturer: ST(意法半导体); Supplier Footprint: SOT-223-4; Datasheet: https://atta.szlcsc.com/upload/public/pdf/source/20191009/C435835_A59AAEE372646CA19274A9A6CBE87923.pdf; Supplier: LCSC; Output Type: Fixed; Voltage - Supply: 18V; Output Voltage: 3.3V; Output Current: 1.2A; Power Supply Rejection Ratio (PSRR): 87dB@(120Hz); Voltage Dropout: 600mV@(1.2A); standby current: 500uA; Noise: 60uVrms; Features: Over Temperature Protection；Over Current Protection；Thermal Shutdown; Operating Temperature: -40℃~+125℃@(Tj); Output Configuration: Positive; Number of Outputs: 1
U21-U24 = BNLESD5D5.0CT1G: Supplier Part: C20416613; Manufacturer: BORN(伯恩半导体); Supplier Footprint: SOD-523; JLCPCB Part Class: Extended Part; Datasheet: https://atta.szlcsc.com/upload/public/pdf/source/20240112/DD5B0A1851B01090EDF064B693DFCFD2.pdf; Supplier: LCSC
USBC1 USBC2 = TYPE-C-31-M-12: Connector Type:Type-C Standard:- Gender:Female Mounting Style:- Number of Contacts:16P Number of Ports:1 Current Rating - Power (Max):5A Operating Temperature Range:- Operating Temperature Range:-; LCSC Part Name: Type-C 母; Supplier Part: C165948; Manufacturer: 韩国韩荣; Supplier Footprint: SMD; Datasheet: https://atta.szlcsc.com/upload/public/pdf/source/20220525/466408E853115E789EDB0DDC29077C05.pdf; Supplier: LCSC; Connector Type: Type-C; Gender: Female; Number of Contacts: 16P; Number of Ports: 1; Current Rating - Power (Max): 5A
Q1 Q2 = MMBT2222ATT1G: Transistor Type: Collector Current (Ic): Collector-Emitter Breakdown Voltage (Vceo): Power Dissipation (Pd): DC Current Gain (hFE@Ic,Vce):35@0.1mA,10V DC Current Gain (hFE@Ic,Vce):35@0.1mA,10V Transition Frequency (fT):300MHz Collector Cut-Off Current (Ic; LCSC Part Name: NPN 电流:600mA 耐压:40V; Supplier Part: C94417; Manufacturer: onsemi(安森美); Supplier Footprint: SC-75(SOT-523); JLCPCB Part Class: Extended Part; Datasheet: https://atta.szlcsc.com/upload/public/pdf/source/20170120/1484891320579.PDF; Supplier: LCSC; DC Current Gain (hFE@Ic,Vce): 35@0.1mA,10V; Transition Frequency (fT): 300MHz; Collector Cut-Off Current (Icbo): 10nA; Collector-Emitter Saturation Voltage (VCE(sat)@Ic,Ib): 300mV@150mA,15mA; Operating Temperature: -55℃~+150℃
R9 R10 = 0805W8F0000T5E_C17477: Type:Thick Film Resistors Resistance: Tolerance:±1% Tolerance:±1% Power(Watts): Overload Voltage (Max): Temperature Coefficient:±800ppm/℃ Temperature Coefficient:±800ppm/℃ Operating Temperature Range:-55℃~+155℃ Operating Temperature Range:-55℃~+155℃; LCSC Part Name: 0Ω ±1% 125mW 厚膜电阻; Supplier Part: C17477; Manufacturer: UNI-ROYAL(厚声); Manufacturer Part: 0805W8F0000T5E; Supplier Footprint: 0805; Datasheet: https://atta.szlcsc.com/upload/public/pdf/source/20200306/C422600_1E6D84923E4A46A82E41ADD87F860B5C.pdf; Supplier: LCSC; Type: Thick Film Resistors; Tolerance: ±1%; Temperature Coefficient: ±800ppm/℃; Operating Temperature Range: -55℃~+155℃
U6 = CH340C: Applications Function:Transceiver USB Protocol:USB 2.0 Voltage - Supply:3.3V；5V Voltage - Supply:3.3V；5V Data Rate:2Mbps; Supplier Part: C84681; Manufacturer: WCH(南京沁恒); Supplier Footprint: SOP-16; JLCPCB Part Class: Extended Part; Datasheet: https://atta.szlcsc.com/upload/public/pdf/source/20250604/33626338A5406B1E2A8163A86C0531AF.pdf; Supplier: LCSC; Applications Function: Transceiver; USB Protocol: USB 2.0; Voltage - Supply: 3.3V；5V; Data Rate: 2Mbps
C18 C35 = CL21A106KAYNNNE_C15850: Capacitance: Tolerance:±10% Tolerance:±10% Voltage Rated: Temperature Coefficient:; LCSC Part Name: 10uF ±10% 25V; Supplier Part: C15850; Manufacturer: SAMSUNG(三星); Manufacturer Part: CL21A106KAYNNNE; Supplier Footprint: 0805; JLCPCB Part Class: Basic Part; Datasheet: https://atta.szlcsc.com/upload/public/pdf/source/20160218/1457707763339.pdf; Supplier: LCSC; Tolerance: ±10%
CARD3 = TF-015_C113206: Card Connection Mode:Self-bouncing Card Type:MicroSD card (TF card) Connector Type:Card Slot Additional Card Detection Pins:Yes Height Above Board:2mm Operating Temperature:-35℃~+85℃ Operating Temperature:-35℃~+85℃; LCSC Part Name: 自弹式 MicroSD卡(TF卡) 卡座; Supplier Part: C113206; Manufacturer: SOFNG(硕方); Supplier Footprint: SMD; JLCPCB Part Class: Extended Part; Datasheet: https://atta.szlcsc.com/upload/public/pdf/source/20250107/55EAE2766286A30B356F9F3AD4004DFD.pdf; Supplier: LCSC; Card Connection Mode: Self-bouncing; Card Type: MicroSD card (TF card); Connector Type: Card Slot; Additional Card Detection Pins: Yes; Height Above Board: 2mm; Operating Temperature: -35℃~+85℃
LED4 = KT-0805Y: Emitted Color:Yellow Power Dissipation:- Forward Current:- Dominant Wavelength:- Dominant Wavelength:- Peak Wavelength:- Diode Configuration:- Lens Color:- Color Temperature:- Color Temperature:- Viewing Angle:- Mounting Sytle:- Operating Temperature:- Op; LCSC Part Name: 0805 黄灯 高亮; Supplier Part: C2296; Manufacturer: KENTO; Supplier Footprint: 0805; JLCPCB Part Class: Basic Part; Datasheet: https://atta.szlcsc.com/upload/public/pdf/source/20160421/1461205044170.pdf; Supplier: LCSC; Emitted Color: Yellow
LED5 = KT-0805G: Lamp Holder Type:- Emitted Color:Emerald Forward Voltage (VF):- Forward Voltage (VF):- Power Dissipation:- Forward Current:- Dominant Wavelength:- Dominant Wavelength:- Peak Wavelength:- Diode Configuration:- Lens Color:- Color Temperature:- Color Tempera; LCSC Part Name: 0805 翠绿 高亮; Supplier Part: C2297; Manufacturer: KENTO; Supplier Footprint: 0805; Datasheet: https://atta.szlcsc.com/upload/public/pdf/source/20170209/1486607340485.pdf; Supplier: LCSC; Emitted Color: Emerald
SW3 SW4 = SKQMBBE010: Circuit:SPST Actuator Style:Rectangle button Mounting Style:Brick nogging Switch Length:6mm Switch Width:3.5mm Switch Height:5mm Contact Current:50mA Voltage Rating (DC):12V With Lamp:- Mechanical Life:-; LCSC Part Name: 6*3.5*5mm 立贴 轻触开关; Supplier Part: C125030; Manufacturer: ALPSALPINE(阿尔卑斯阿尔派); Supplier Footprint: SMD; JLCPCB Part Class: Extended Part; Datasheet: https://atta.szlcsc.com/upload/public/pdf/source/20170810/C125030_1502335333454879890.pdf; Supplier: LCSC; Circuit: SPST; Actuator Style: Rectangle button; Mounting Style: Brick nogging; Switch Length: 6mm; Switch Width: 3.5mm; Switch Height: 5mm; Contact Current: 50mA; Voltage Rating (DC): 12V
U4 = ESP32-S3-WROOM-1-N8: Core Processor:ESP32-S3 Chip Support Interface:I2C；GPIO；SPI；PWM；ADC；UART；USB；I2S Frequency:2.4GHz; LCSC Part Name: 通用型Wi-Fi+低功耗蓝牙MCU模组; Supplier Part: C2913198; Manufacturer: ESPRESSIF(乐鑫); Supplier Footprint: SMD,18x25.5mm; JLCPCB Part Class: Extended Part; Datasheet: https://atta.szlcsc.com/upload/public/pdf/source/20221026/9A44C6421221D672346AAE72DF9F8146.pdf; Supplier: LCSC; Core Processor: ESP32-S3 Chip; Support Interface: I2C；GPIO；SPI；PWM；ADC；UART；USB；I2S
U25-U28 = PAD_D3.3_M3Screw_1: Supplier Part: C9900016282; Supplier Footprint: SCREW; JLCPCB Part Class: Extended Part; Supplier: LCSC

## Nets
+3V3: C16.2 C37.2 C38.2 L10.1 L13.1 LED4.1(+) LED5.1(A) R15.2 TP2.1 TP8.1 U6.4(V3) U9.2(VOUT) U9.4(VOUT)
+4V: C24.2 C25.2 C28.2 C29.2 C30.2 C31.2 C32.1 C33.2 TP14.1 TP16.1 TP17.1 TP18.1 TP19.1 TP20.1 U1.27(Vin) U10.9(OUTS) U10.10(OUT) U12.2(EN) U12.14(VDD) U13.2(EN) U13.14(VDD)
+5V: C15.2 C26.2 C27.2 C36.2 LED1.2(A) TP3.1 TP15.1 U8.2(VOUT) U8.7(VOUT) U9.3(VIN) U10.1(IN) U10.2(IN) U10.3(EN/UV) U10.6(PGFB)
+5V_USB1: C2.2 C6.2 C22.2 L3.2 R14.2 TP1.1 TP4.1 U5.12(VCC) U8.3(VIN1)
+5V_USB2: C10.2 C13.2 C21.2 L7.2 TP5.1 TP6.1 TP7.1 U6.16(VCC) U8.6(VIN2)
GND: C1.1 C2.1 C4.2 C5.1 C6.1 C9.1 C10.1 C12.2 C13.1 C14.1 C15.1 C16.1 C17.1 C18.1 C21.1 C22.1 C23.1 C24.1 C25.1 C26.1 C27.1 C28.1 C29.1 C30.1 C31.1 C32.2 C33.1 C34.1 C35.1 C36.1 C37.1 C38.1 C39.1 C40.1 CARD3.6(VSS) CARD3.10(GND) CARD3.11(GND) CARD3.12(GND) CARD3.13(GND) D1.1 D2.1 R1.1 R2.1 R3.2 R11.1 R12.1 R13.2 R16.1 R29.1 SW3.2 SW4.2 U1.8(DGND) U1.15(AGND) U1.28(DGND) U4.1(GND) U4.40(GND) U4.41(EP) U5.5(GND) U5.13(GND) U6.1(GND) U8.1(GND) U8.4(ON#) U8.5(GND) U9.1(GND) U10.5(ILIM) U10.8(GND) U10.11(GND) U12.3(VSS) U12.15(GND) U13.3(VSS) U13.15(GND) U20.3 U21.1 U22.1 U23.1 U24.1 U25.1 U26.1 U27.1 U28.1 USBC1.A1(GND) USBC1.A12(GND) USBC1.B1(GND) USBC1.B12(GND) USBC2.A1(GND) USBC2.A12(GND) USBC2.B1(GND) USBC2.B12(GND)
VBUS1: D1.2 L2.1 USBC1.A4(VBUS) USBC1.A9(VBUS) USBC1.B4(VBUS) USBC1.B9(VBUS)
VBUS2: D2.2 L6.1 USBC2.A4(VBUS) USBC2.A9(VBUS) USBC2.B4(VBUS) USBC2.B9(VBUS)
VCC_SD: C34.2 C35.2 CARD3.4(VDD) L13.2 R18.2 R19.2 R20.2 R21.2 R22.2 R32.2 TP10.1 TP11.1
CE1: U12.4(S1A) U17.3
CE2: U12.5(S2A) U17.2
CE3: U12.6(S3A) U17.1
CE_RE_MUX_0: SW2.11(B6) SW2.15(B2) TP23.1 U12.1(A0)
CE_RE_MUX_1: SW2.12(B5) SW2.16(B1) TP24.1 U12.16(A1)
D+: R5.1 U21.2 USBC1.A6(DP1) USBC1.B6(DP2)
D-: R4.1 U22.2 USBC1.A7(DN1) USBC1.B7(DN2)
DN: U6.6(D-) U24.2 USBC2.A7(DN1) USBC2.B7(DN2)
DP: U6.5(D+) U23.2 USBC2.A6(DP1) USBC2.B6(DP2)
DTR: Q2.2(E) R7.1 U6.13(DTR#)
ESP_CE_RE_MUX_0: SW2.2(A2) U4.6(IO6)
ESP_CE_RE_MUX_1: SW2.1(A1) U4.7(IO7)
ESP_EN: C14.2 C40.2 R9.2 R15.1 SW4.1 TP12.1 U4.3(EN)
ESP_GPIO0: C39.2 R10.2 SW3.1 U4.27(IO0)
ESP_RX0: U4.36(RXD0) U6.2(TXD)
ESP_RX_1: SW1.4(A4) U4.11(IO18)
ESP_TX0: U4.37(TXD0) U6.3(RXD)
ESP_TX_1: SW1.3(A3) U4.10(IO17)
ESP_WE_MUX_0: SW2.4(A4) U4.4(IO4)
ESP_WE_MUX_1: SW2.3(A3) U4.5(IO5)
FTDI_RX: SW1.2(A2) U5.4(RXD)
FTDI_TX: SW1.1(A1) U5.1(TXD)
IO15: U4.8(IO15) U20.1
IO16: U4.9(IO16) U20.2
IO35: CARD3.1(DAT2(RSV)) R20.1 U4.28(IO35)
IO36: CARD3.2(CDDAT3(CS)) R19.1 U4.29(IO36)
IO37: CARD3.3(CMD(DI)) R18.1 U4.30(IO37)
IO38: CARD3.5(CLK(SCLK)) U4.31(IO38)
IO39: CARD3.7(DAT0(D0)) R22.1 U4.32(IO39)
IO40: CARD3.8(DAT1(RSV)) R21.1 U4.33(IO40)
LED_GREEN: R31.1 U4.19(IO11)
LED_YELLOW: R30.1 U4.18(IO10)
PICO_CE0: U1.18(CE_0) U12.8(DA)
PICO_CE_RE_MUX_0: SW2.6(A6) U1.9(GPIO_2)
PICO_CE_RE_MUX_1: SW2.5(A5) U1.10(GPIO_3)
PICO_DWNLD: U1.4(DWN) U5.15(CBUS0)
PICO_RE0: U1.16(RE_0) U12.9(DB)
PICO_RESET: U1.5(RST) U5.14(CBUS1)
PICO_WE0: U1.17(WE_0) U13.8(DA)
PICO_WE_MUX_0: SW2.8(A8) U1.6(GPIO_0)
PICO_WE_MUX_1: SW2.7(A7) U1.7(GPIO_1)
RE1: U12.13(S1B) U15.1
RE2: U12.12(S2B) U15.2
RE3: U12.11(S3B) U15.3
REGEN_1: U4.23(IO21) U19.1
REGEN_2: U4.24(IO47) U19.2
REGEN_3: U4.25(IO48) U19.3
RTS: Q1.2(E) R8.1 U6.14(RTS#)
SD_CD: CARD3.9(CD) R32.1 U4.34(IO41)
WE1: U13.4(S1A) U14.3
WE2: U13.5(S2A) U14.2
WE3: U13.6(S3A) U14.1
WE_MUX_0: SW2.9(B8) SW2.13(B4) TP21.1 U13.1(A0)
WE_MUX_1: SW2.10(B7) SW2.14(B3) TP22.1 U13.16(A1)
$1N3181: SW1.5(B4) SW1.7(B2) U1.3(TX)
$1N3306: SW1.6(B3) SW1.8(B1) U1.2(RX)
$1N4229: C23.2 R16.2 U10.7(SET)
$2N1160: R1.2 USBC1.A5(CC1)
$2N1249: R2.2 USBC1.B5(CC2)
$2N1352: C4.1 R3.1 USBC1.0(SH) USBC1.1(SH) USBC1.2(SH) USBC1.3(SH)
$2N1683: R5.2 U5.8(USBDP)
$2N1687: R4.2 U5.9(USBDM)
$2N1704: C1.2 L2.2 L3.1
$2N1813: C5.2 TP9.1 U5.3(VCCIO) U5.10(3V3OUT) U5.11(RESET#)
$2N3429: R14.1 U8.8(ST)
$2N6221: LED1.1(K) R29.2
$3N962: Q1.1(B) R7.2
$3N966: Q2.1(B) R8.2
$3N1119: Q1.3(C) R9.1
$3N1124: Q2.3(C) R10.1
$3N1946: R11.2 USBC2.A5(CC1)
$3N1959: R12.2 USBC2.B5(CC2)
$3N1980: C12.1 R13.1 USBC2.0(SH) USBC2.1(SH) USBC2.2(SH) USBC2.3(SH)
$3N1995: C9.2 L6.2 L7.1
$4N789: C17.2 C18.2 L10.2 TP13.1 U4.2(3V3)
$4N4126: LED4.2(-) R30.2
$4N4284: LED5.2(K) R31.2

Not connected (* = marked no-connect by the designer): U1 1(NC) 11(GPIO_4)* 12(CE_1)* 13(WE_1)* 14(RE_1)* 19(Ain_2)* 20(Ain_1)* 21(Ain_0)* 22(GPIO_5)* 23(GPIO_6)* 24(GPIO_7)* 25(I2C_SCL)* 26(I2C_SDA)*; U4 12(IO8)* 13(IO19)* 14(IO20)* 15(IO3)* 16(IO46)* 17(IO9)* 20(IO12)* 21(IO13)* 22(IO14)* 26(IO45)* 35(IO42)* 38(IO2)* 39(IO1)*; U5 2(RTS#)* 6(CTS#)* 7(CBUS2)* 16(CBUS3)*; U6 7(NC.)* 8(OUT#)* 9(CTS#)* 10(DSR#)* 11(RI#)* 12(DCD#)* 15(R232)*; U10 4(PG)*; U12 7(S4A)* 10(S4B)*; U13 7(S4A)* 9(DB)* 10(S4B)* 11(S3B)* 12(S2B)* 13(S1B)*; USBC1 A8(SBU1)* B8(SBU2)*; USBC2 A8(SBU1)* B8(SBU2)*

## Notes on the sheets
sheet 1
- PICO TX/RX --> USB or ESP32
- CE/RE/WE Sensor Connectors
- CE/RE MUX
- WE MUX
- MUX signals either from emstat pico or esp32
- Low Noise +4V Regulator
sheet 2
- USB to UART EmStat Pico + Regulators
- +3.3V Regulator
- USB to UART FTDI Chip
- USB Type-C Connector
- +5V power mux
sheet 3
- USB to UART ESP32
- USB to UART CH340C
- ESP32 Auto Program Loader
- USB Type-C Connector
sheet 4
- ESP32
- ESP_BOOT
- ESP_RESET
- MicroSD Card Slot
